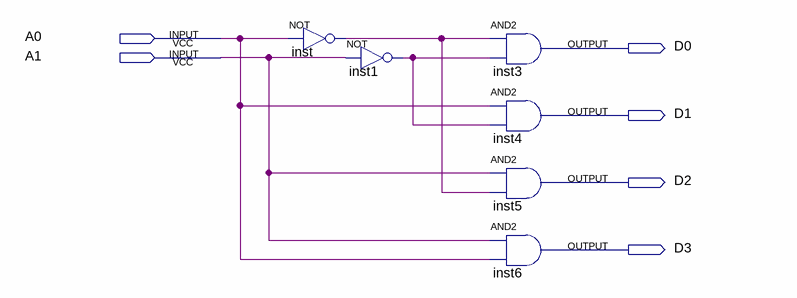
[diagram p0: schematic sheet]
// Quartus schematic 2to4.bdf as structural Verilog: 6 symbols, 6 pins
module \2to4  (
  input  A0,
  input  A1,
  output D0,
  output D1,
  output D2,
  output D3
);

  wire inst1_out, inst_out;

  not inst (inst_out, A0);
  not inst1 (inst1_out, A1);
  and inst3 (D0, inst_out, inst1_out);
  and inst4 (D1, A0, inst1_out);
  and inst5 (D2, A1, inst_out);
  and inst6 (D3, A1, A0);
endmodule
